# EAGLE design audio_webcam_final (EAGLE 7.7.0)
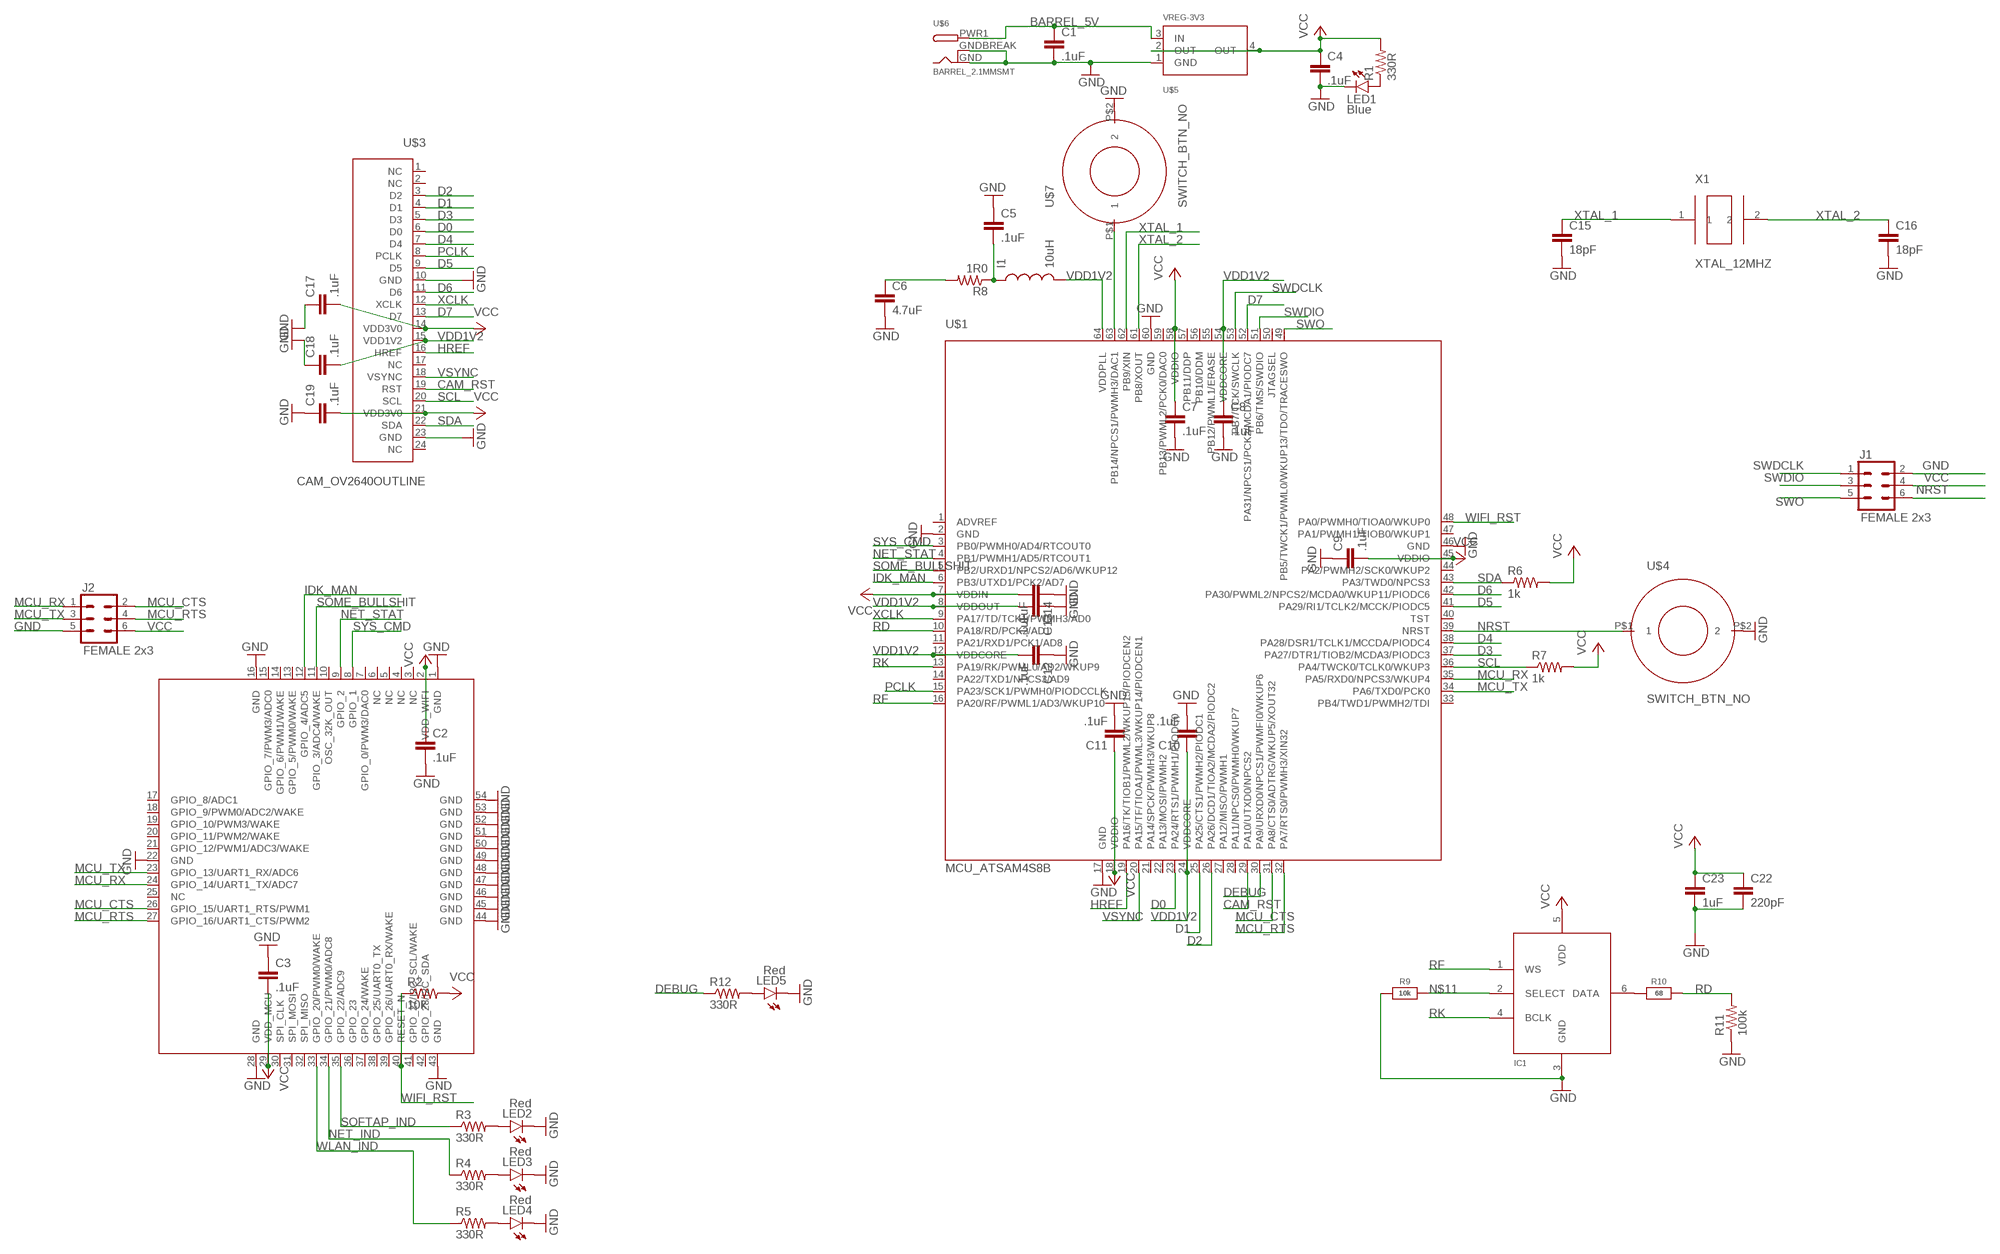
[diagram p0: schematic, sheet 1]

## Parts
C1  .1uF  CAP  [0805]
C2  .1uF  CAP  [0805]
C3  .1uF  CAP  [0805]
C4  .1uF  CAP  [0805]
C5  .1uF  CAP  [0805]
C6  4.7uF  CAP  [0805]
C7  .1uF  CAP  [0805]
C8  .1uF  CAP  [0805]
C9  .1uF  CAP  [0805]
C10  .1uF  CAP  [0805]
C11  .1uF  CAP  [0805]
C12  .1uF  CAP  [0805]
C13  .1uF  CAP  [0805]
C14  .1uF  CAP  [0805]
C15  18pF  CAP  [0805]
C16  18pF  CAP  [0805]
C17  .1uF  CAP  [0805]
C18  .1uF  CAP  [0805]
C19  .1uF  CAP  [0805]
C22  220pF  CAP  [0805]
C23  1uF  CAP  [0805]
I1  10uH  IND  [0805]
IC1  MIC_I2S_SPH0645  [SPH0645LM4H]
J1  FEMALE 2x3  CONN_03X2FEMALE  [2X3]
J2  FEMALE 2x3  CONN_03X2FEMALE  [2X3]
LED1  Blue  LED0603  [LED-0603]
LED2  Red  LED0603  [LED-0603]
LED3  Red  LED0603  [LED-0603]
LED4  Red  LED0603  [LED-0603]
LED5  Red  LED0603  [LED-0603]
R1  330R  RES  [0805]
R2  10k  RES  [0805]
R3  330R  RES  [0805]
R4  330R  RES  [0805]
R5  330R  RES  [0805]
R6  1k  RES  [0805]
R7  1k  RES  [0805]
R8  1R0  RES  [0805]
R9  10k  RESISTOR_0603_NOOUT  [0603-NO]
R10  68  RESISTOR_0603_NOOUT  [0603-NO]
R11  100k  RES  [0805]
R12  330R  RES  [0805]
U$1  MCU_ATSAM4S8B  [QFP50P1200X1200X160-64N]
U$2  WIFI_AMW004  [AMW004]
U$3  CAM_OV2640OUTLINE  [CAM_CONN]
U$4  SWITCH_BTN_NO  [BTN_2]
U$5  VREG-3V3  [R-PDSO-G4_TI]
U$6  BARREL_2.1MMSMT  [DCJACK_2MM_SMT]
U$7  SWITCH_BTN_NO  [BTN_2]
X1  XTAL_12MHZ  [ABM7-16.000MHZ-D2Y-T]

## Nets
BARREL_5V: C1.1 U$5.3(IN) U$6.PWR1(PWR)
CAM_RST: U$1.29(PA10/UTXD0/NPCS2) U$3.19(RST)
D0: U$1.23(PA24/RTS1/PWMH1/PIODC0) U$3.6(D0)
D1: U$1.25(PA25/CTS1/PWMH2/PIODC1) U$3.4(D1)
D2: U$1.26(PA26/DCD1/TIOA2/MCDA2/PIODC2) U$3.3(D2)
D3: U$1.37(PA27/DTR1/TIOB2/MCDA3/PIODC3) U$3.5(D3)
D4: U$1.38(PA28/DSR1/TCLK1/MCCDA/PIODC4) U$3.7(D4)
D5: U$1.41(PA29/RI1/TCLK2/MCCK/PIODC5) U$3.9(D5)
D6: U$1.42(PA30/PWML2/NPCS2/MCDA0/WKUP11/PIODC6) U$3.11(D6)
D7: U$1.52(PA31/NPCS1/PCK2/MCDA1/PIODC7) U$3.13(D7)
DEBUG: R12.1 U$1.30(PA9/URXD0/NPCS1/PWMFI0/WKUP6)
GND: C1.2 C2.2 C3.1 C4.2 C5.1 C6.2 C7.2 C8.2 C9.1 C10.2 C11.2 C12.1 C13.1 C14.1 C15.2 C16.2 C17.1 C18.1 C19.1 C22.2 C23.2 IC1.3(GND) J1.2 J2.5 LED1.C LED2.C LED3.C LED4.C LED5.C R9.1 R11.1 U$1.2(GND) U$1.17(GND) U$1.46(GND) U$1.60(GND) U$2.1(GND) U$2.16(GND) U$2.22(GND) U$2.28(GND) U$2.43(GND) U$2.44(GND) U$2.45(GND) U$2.46(GND) U$2.47(GND) U$2.48(GND) U$2.49(GND) U$2.50(GND) U$2.51(GND) U$2.52(GND) U$2.53(GND) U$2.54(GND) U$3.10(GND) U$3.23(GND) U$4.P$2 U$5.1(GND) U$6.GND U$6.GNDBREAK U$7.P$2
HREF: U$1.19(PA16/TK/TIOB1/PWML2/WKUP15/PIODCEN2) U$3.16(HREF)
IDK_MAN: U$1.6(PB3/UTXD1/PCK2/AD7) U$2.12(GPIO_4/ADC5)
MCU_CTS: J2.2 U$1.31(PA8/CTS0/ADTRG/WKUP5/XOUT32) U$2.26(GPIO_15/UART1_RTS/PWM1)
MCU_RTS: J2.4 U$1.32(PA7/RTS0/PWMH3/XIN32) U$2.27(GPIO_16/UART1_CTS/PWM2)
MCU_RX: J2.1 U$1.35(PA5/RXD0/NPCS3/WKUP4) U$2.24(GPIO_14/UART1_TX/ADC7)
MCU_TX: J2.3 U$1.34(PA6/TXD0/PCK0) U$2.23(GPIO_13/UART1_RX/ADC6)
N$1: LED2.A R3.2
N$2: LED3.A R4.2
N$3: LED4.A R5.2
N$4: C5.2 I1.1 R8.1
N$5: C6.1 R8.2
N$6: LED1.A R1.1
N$7: U$1.63(PB14/NPCS1/PWMH3/DAC1) U$7.P$1
N$8: LED5.A R12.2
N$11: IC1.2(SELECT) R9.2
N$12: IC1.6(DATA) R10.1
NET_IND: R4.1 U$2.34(GPIO_21/PWM0/ADC8)
NET_STAT: U$1.4(PB1/PWMH1/AD5/RTCOUT1) U$2.9(GPIO_2)
NRST: J1.6 U$1.39(NRST) U$4.P$1
PCLK: U$1.15(PA23/SCK1/PWMH0/PIODCCLK) U$3.8(PCLK)
RD: R10.2 R11.2 U$1.10(PA18/RD/PCK2/AD1)
RF: IC1.1(WS) U$1.16(PA20/RF/PWML1/AD3/WKUP10)
RK: IC1.4(BCLK) U$1.13(PA19/RK/PWML0/AD2/WKUP9)
SCL: R7.1 U$1.36(PA4/TWCK0/TCLK0/WKUP3) U$3.20(SCL)
SDA: R6.1 U$1.43(PA3/TWD0/NPCS3) U$3.22(SDA)
SOFTAP_IND: R3.1 U$2.35(GPIO_22/ADC9)
SOME_BULLSHIT: U$1.5(PB2/URXD1/NPCS2/AD6/WKUP12) U$2.11(GPIO_3/ADC4/WAKE)
SWDCLK: J1.1 U$1.53(PB7/TCK/SWCLK)
SWDIO: J1.3 U$1.51(PB6/TMS/SWDIO)
SWO: J1.5 U$1.49(PB5/TWCK1/PWML0/WKUP13/TDO/TRACESWO)
SYS_CMD: U$1.3(PB0/PWMH0/AD4/RTCOUT0) U$2.8(GPIO_1)
VCC: C2.1 C3.2 C4.1 C7.1 C9.2 C11.1 C14.2 C17.2 C19.2 C22.1 C23.1 IC1.5(VDD) J1.4 J2.6 R1.2 R2.2 R6.2 R7.2 U$1.7(VDDIN) U$1.18(VDDIO) U$1.45(VDDIO) U$1.58(VDDIO) U$2.2(VDD_WIFI) U$2.29(VDD_MCU) U$3.14(VDD3V0) U$3.21(VDD3V0) U$5.2(OUT) U$5.4(OUT)
VDD1V2: C8.1 C10.1 C12.2 C13.2 C18.2 I1.2 U$1.8(VDDOUT) U$1.12(VDDCORE) U$1.24(VDDCORE) U$1.54(VDDCORE) U$1.64(VDDPLL) U$3.15(VDD1V2)
VSYNC: U$1.20(PA15/TF/TIOA1/PWML3/WKUP14/PIODCEN1) U$3.18(VSYNC)
WIFI_RST: R2.1 U$1.48(PA0/PWMH0/TIOA0/WKUP0) U$2.40(RESET_N)
WLAN_IND: R5.1 U$2.33(GPIO_20/PWM0/WAKE)
XCLK: U$1.9(PA17/TD/TCK1/PWMH3/AD0) U$3.12(XCLK)
XTAL_1: C15.1 U$1.62(PB9/XIN) X1.1
XTAL_2: C16.1 U$1.61(PB8/XOUT) X1.2
Unconnected: U$1.1(ADVREF) U$1.11(PA21/RXD1/PCK1/AD8) U$1.14(PA22/TXD1/NPCS3/AD9) U$1.21(PA14/SPCK/PWMH3/WKUP8) U$1.22(PA13/MOSI/PWMH2) U$1.27(PA12/MISO/PWMH1) U$1.28(PA11/NPCS0/PWMH0/WKUP7) U$1.33(PB4/TWD1/PWMH2/TDI) U$1.40(TST) U$1.44(PA2/PWMH2/SCK0/WKUP2) U$1.47(PA1/PWMH1/TIOB0/WKUP1) U$1.50(JTAGSEL) U$1.55(PB12/PWML1/ERASE) U$1.56(PB10/DDM) U$1.57(PB11/DDP) U$1.59(PB13/PWML2/PCK0/DAC0) U$2.3(NC) U$2.4(NC) U$2.5(NC) U$2.6(NC) U$2.7(GPIO_0/PWM3/DAC0) U$2.10(OSC_32K_OUT) U$2.13(GPIO_5/PWM0/WAKE) U$2.14(GPIO_6/PWM1/WAKE) U$2.15(GPIO_7/PWM3/ADC0) U$2.17(GPIO_8/ADC1) U$2.18(GPIO_9/PWM0/ADC2/WAKE) U$2.19(GPIO_10/PWM3/WAKE) U$2.20(GPIO_11/PWM2/WAKE) U$2.21(GPIO_12/PWM1/ADC3/WAKE) U$2.25(NC) U$2.30(SPI_CLK) U$2.31(SPI_MOSI) U$2.32(SPI_MISO) U$2.36(GPIO_23) U$2.37(GPIO_24/WAKE) U$2.38(GPIO_25/UART0_TX) U$2.39(GPIO_26/UART0_RX/WAKE) U$2.41(GPIO_27/I2C_SCL/WAKE) U$2.42(GPIO_28/I2C_SDA) U$3.1(NC) U$3.2(NC) U$3.17(NC) U$3.24(NC)

## Library data of the parts
C1-C19 C22 C23 = Ilya_Teach:CAP
I1 = Ilya_Teach:IND
IC1 = Adafruit I2S Mic SPK0415HM4H:MIC_I2S
J1 J2 = SparkFun-Connectors:CONN_03X2: Multi connection point. Often used as Generic Header-pin footprint for 0.1 inch spaced/style header connections You can populate with any combo of single row headers, but if you'd like an exact match, check these: Header - 2x3 (Male, 0.1") <https://www.sparkfun.com/products/12807> (PRT-12807) Header - 2x3 (Female, 0.1") <https://www.sparkfun.com/products/13010> (PRT-13010) 2x3 Pin Shrouded Header <https://www.sparkfun.com/products/10877> (PRT-10877) On any of the 0.1 inch spaced packages, you can populate with these: Break Away Headers - Straight <https://www.sparkfun.com/products/116> (PRT-00116) Break Away Male Headers - Right Angle <https://www.sparkfun.com/products/553> (PRT-00553) Female Headers <https://www.sparkfun.com/products/115> (PRT-00115) Break Away Headers - Machine Pin <https://www.sparkfun.com/products/117> (PRT-00117) Break Away Female Headers - Swiss Machine Pin <https://www.sparkfun.com/products/743> (PRT-00743) Special note: the shrouded connector mates well with our 3x2 ribbon cables: Ribbon Crimp Connector - 6-pin (2x3, Female) <https://www.sparkfun.com/products/10651> (PRT-10651) Ribbon Cable - 6 wire (15ft) <https://www.sparkfun.com/products/10646> (PRT-10646); PROD_ID: CONN-11566
LED1-LED5 = Ilya_Teach:LED: LEDs Standard schematic elements and footprints for 5mm, 3mm, 1206, and 0603 sized LEDs. 5mm - Spark Fun Electronics SKU : COM-00529 (and others)
R1-R8 R11 R12 = Ilya_Teach:RES
R9 R10 = Adafruit I2S Mic SPK0415HM4H:RESISTOR: Resistors For new designs, use the packages preceded by an '_' character since they are more reliable: The following footprints should be used on most boards: _0402 - Standard footprint for regular board layouts _0603 - Standard footprint for regular board layouts _0805 - Standard footprint for regular board layouts _1206 - Standard footprint for regular board layouts For extremely tight-pitch boards where space is at a premium, the following 'micro-pitch' footprints can be used (smaller pads, no silkscreen outline, etc.): _0402MP - Micro-pitch footprint for very dense/compact boards _0603MP - Micro-pitch footprint for very dense/compact boards _0805MP - Micro-pitch footprint for very dense/compact boards _1206MP - Micro-pitch footprint for very dense/compact boards
U$1 = Ilya_Teach:MCU_ATSAM4S8B
U$2 = Ilya_Teach:WIFI_AMW004
U$3 = Ilya_Teach:CAM_OV2640
U$4 U$7 = Ilya_Teach:SWITCH_BTN_NO
U$5 = Ilya_Teach:VREG-3V3
U$6 = Ilya_Teach:BARREL_2.1MM
X1 = Ilya_Teach:XTAL_12MHZ

## Board
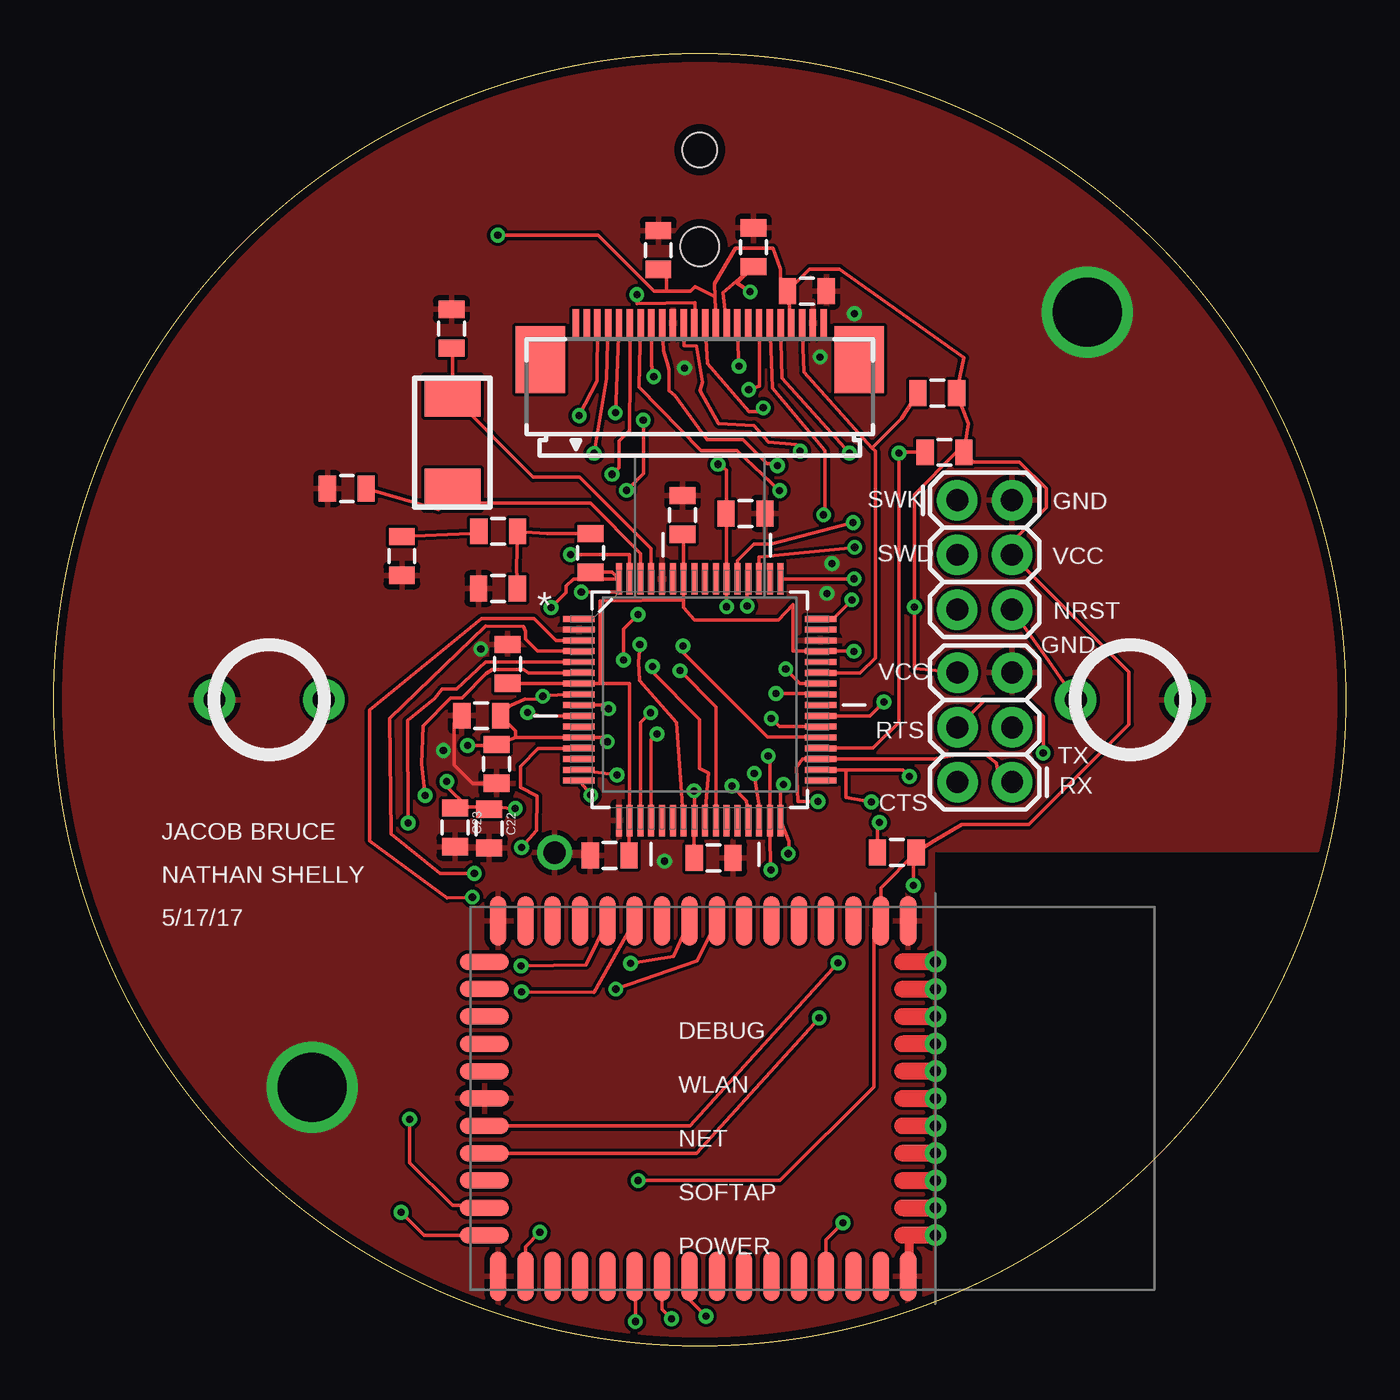
[diagram p1: board, top side]
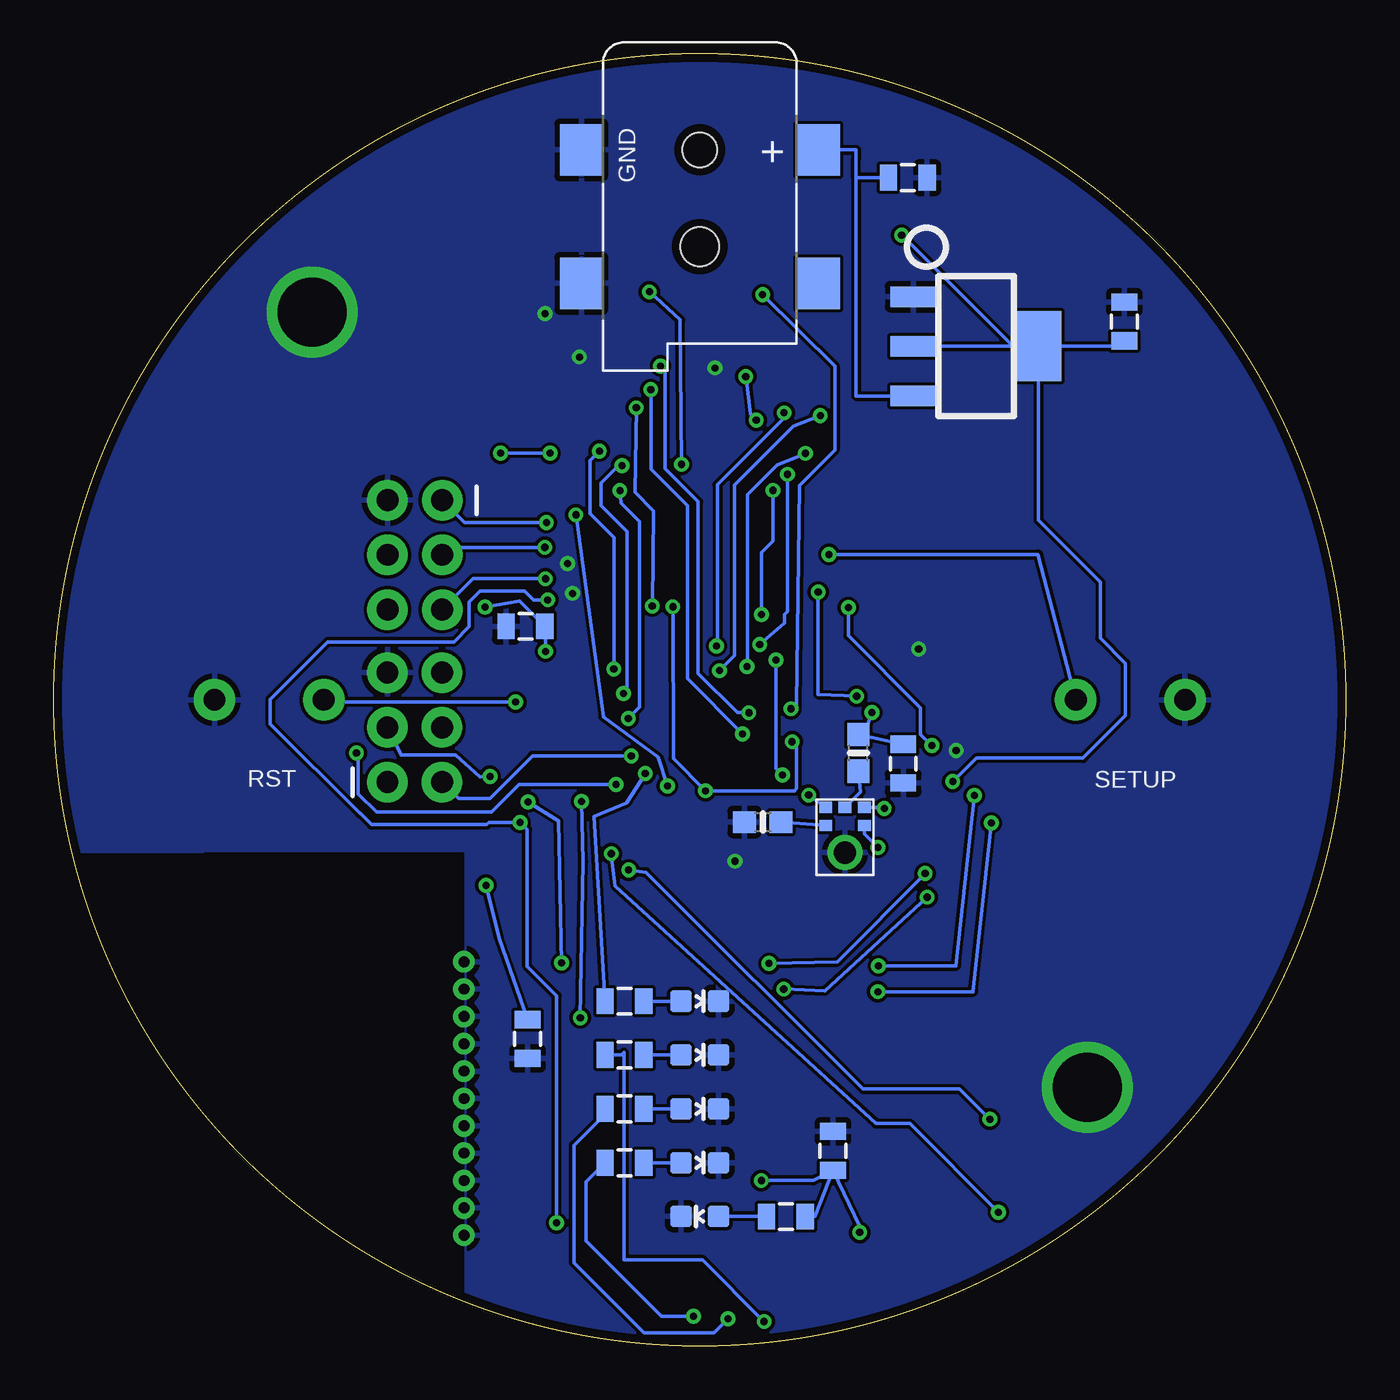
[diagram p2: board, bottom side, seen from below]

Size 60 x 60 mm. Coordinates in mm from the lower left corner, seen from the top.
Outline: circle at 30,30 radius 30
Copper layers (1*16): Top 0.0356mm / dielectric 1.5011mm / Bottom 0.0356mm
Design rules "LaenPCBOrder": minimum track width 6mil, minimum drill 13mil, track to track 6mil, track to pad 6mil, pad to pad 6mil, via to via 6mil, smd to smd 6mil, copper to edge 15mil, drill to drill 6mil, minimum pad ring 7mil, minimum via ring 7mil, stop-mask expansion 3mil, vias tented up to drill 0mil, thermal gap 10mil
tRestrict: area 53,11.1 to 58.9,22.9
bRestrict: area 53,11.1 to 58.9,22.9

### Footprints (pad centres in the part's own frame; a part is rotated, then mirrored left to right if it is on the bottom)
0805 = smd 0.8 x 1.2: 1 -0.9,0; 2 0.9,0
SPH0645LM4H = smd 0.6 x 0.525: 1 -0.9,1.4; 2 -0.9,0.55; 4 0.9,0.55; 5 0.9,1.4; 6 0,1.4 | drill 1.025 pad 1.625: 3 0,-0.71
2X3 = drill 1.016 pad 1.88: 1 0,0; 2 0,2.54; 3 2.54,0; 4 2.54,2.54; 5 5.08,0; 6 5.08,2.54
LED-0603 = smd 1 x 1: A 0,-0.877; C 0,0.877
0603-NO = smd 1.075 x 1: 1 -0.85,0; 2 0.85,0
QFP50P1200X1200X160-64N = smd 1.473 x 0.279: 1 -5.613,3.759; 2 -5.613,3.251; 3 -5.613,2.743; 4 -5.613,2.261; 5 -5.613,1.753; 6 -5.613,1.245; 7 -5.613,0.762; 8 -5.613,0.254; 9 -5.613,-0.254; 10 -5.613,-0.762; 11 -5.613,-1.245; 12 -5.613,-1.753; 13 -5.613,-2.261; 14 -5.613,-2.743; 15 -5.613,-3.251; 16 -5.613,-3.759; 33 5.613,-3.759; 34 5.613,-3.251; 35 5.613,-2.743; 36 5.613,-2.261; 37 5.613,-1.753; 38 5.613,-1.245; 39 5.613,-0.762; 40 5.613,-0.254; 41 5.613,0.254; 42 5.613,0.762; 43 5.613,1.245; 44 5.613,1.753; 45 5.613,2.261; 46 5.613,2.743; 47 5.613,3.251; 48 5.613,3.759 | smd 0.279 x 1.473: 17 -3.759,-5.613; 18 -3.251,-5.613; 19 -2.743,-5.613; 20 -2.261,-5.613; 21 -1.753,-5.613; 22 -1.245,-5.613; 23 -0.762,-5.613; 24 -0.254,-5.613; 25 0.254,-5.613; 26 0.762,-5.613; 27 1.245,-5.613; 28 1.753,-5.613; 29 2.261,-5.613; 30 2.743,-5.613; 31 3.251,-5.613; 32 3.759,-5.613; 49 3.759,5.613; 50 3.251,5.613; 51 2.743,5.613; 52 2.261,5.613; 53 1.753,5.613; 54 1.245,5.613; 55 0.762,5.613; 56 0.254,5.613; 57 -0.254,5.613; 58 -0.762,5.613; 59 -1.245,5.613; 60 -1.753,5.613; 61 -2.261,5.613; 62 -2.743,5.613; 63 -3.251,5.613; 64 -3.759,5.613
AMW004 = smd 0.762 x 2.286: 1 20.32,8.255; 2 19.05,8.255; 3 17.78,8.255; 4 16.51,8.255; 5 15.24,8.255; 6 13.97,8.255; 7 12.7,8.255; 8 11.43,8.255; 9 10.16,8.255; 10 8.89,8.255; 11 7.62,8.255; 12 6.35,8.255; 13 5.08,8.255; 14 3.81,8.255; 15 2.54,8.255; 16 1.27,8.255; 28 1.27,-8.255; 29 2.54,-8.255; 30 3.81,-8.255; 31 5.08,-8.255; 32 6.35,-8.255; 33 7.62,-8.255; 34 8.89,-8.255; 35 10.16,-8.255; 36 11.43,-8.255; 37 12.7,-8.255; 38 13.97,-8.255; 39 15.24,-8.255; 40 16.51,-8.255; 41 17.78,-8.255; 42 19.05,-8.255; 43 20.32,-8.255 | smd 2.286 x 0.762: 17 0.635,6.35; 18 0.635,5.08; 19 0.635,3.81; 20 0.635,2.54; 21 0.635,1.27; 22 0.635,0; 23 0.635,-1.27; 24 0.635,-2.54; 25 0.635,-3.81; 26 0.635,-5.08; 27 0.635,-6.35 | drill 0.5 pad 1: 44 21.59,-6.35; 45 21.59,-5.08; 46 21.59,-3.81; 47 21.59,-2.54; 48 21.59,-1.27; 49 21.59,0; 50 21.59,1.27; 51 21.59,2.54; 52 21.59,3.81; 53 21.59,5.08; 54 21.59,6.35
CAM_CONN = smd 0.3 x 1.3: 1 -5.75,3.25; 2 -5.25,3.25; 3 -4.75,3.25; 4 -4.25,3.25; 5 -3.75,3.25; 6 -3.25,3.25; 7 -2.75,3.25; 8 -2.25,3.25; 9 -1.75,3.25; 10 -1.25,3.25; 11 -0.75,3.25; 12 -0.25,3.25; 13 0.25,3.25; 14 0.75,3.25; 15 1.25,3.25; 16 1.75,3.25; 17 2.25,3.25; 18 2.75,3.25; 19 3.25,3.25; 20 3.75,3.25; 21 4.25,3.25; 22 4.75,3.25; 23 5.25,3.25; 24 5.75,3.25 | smd 2.3 x 3.1: P1 -7.4,1.55; P2 7.4,1.55
BTN_2 = drill 1.016 pad 1.93: P$1 -2.54,0; P$2 2.54,0
R-PDSO-G4_TI = smd 0.95 x 2.15: 1 -2.3,-2.9; 2 0,-2.9; 3 2.3,-2.9 | smd 3.25 x 2.15: 4 0,2.9
DCJACK_2MM_SMT = smd 2.4 x 2: GND -2.54,-5.5; GNDBREAK 3.66,-5.5; PWR1 -2.54,5.5; PWR2 3.66,5.5 | hole 1.6: -2.54,0 | hole 1.8: 1.96,0
ABM7-16.000MHZ-D2Y-T = smd 1.9 x 2.6: 1 -2.15,0; 2 2.15,0

### Placement (x,y rotation side)
C1  20.34,54.25 0 bottom
C2  21.07,31.67 90 top
C3  25.81,22.77 0 top
C4  38.09,33.41 180 bottom
C5  20.63,35.16 0 top
C6  16.17,36.68 270 top
C7  34.98,48.98 0 top
C8  32.12,38.65 0 top
C9  28.07,50.89 270 top
C10  32.49,51.02 90 top
C11  29.2,38.58 90 top
C12  19.85,29.26 0 top
C13  30.64,22.65 180 top
C14  37.99,14.24 90 bottom
C15  13.61,39.81 180 top
C16  18.47,47.23 90 top
C17  23.81,9.05 270 bottom
C18  20.57,27.02 90 top
C19  10.28,47.57 270 bottom
C22  20.22,24.02 270 top
C23  18.63,24.07 270 top
I1  24.93,36.82 270 top
IC1  23.25,23.61 0 bottom
J1  41.96,39.27 270 top
J2  44.51,26.18 90 top
LED1  30,6 90 bottom
LED2  30,8.5 270 bottom
LED3  30,11 270 bottom
LED4  30,13.5 270 bottom
LED5  30,16 270 bottom
R1  26,6 0 bottom
R2  39.15,22.91 0 top
R3  33.5,8.5 0 bottom
R4  33.5,11 0 bottom
R5  33.5,13.5 0 bottom
R6  41.03,44.24 0 top
R7  41.37,41.49 0 top
R8  20.63,37.82 180 top
R9  27.07,24.32 0 bottom
R10  22.63,27.53 90 bottom
R11  20.55,27.03 90 bottom
R12  33.5,16 0 bottom
U$1  30,30 0 top
U$2  19.36,11.48 0 top
U$3  30,44.25 0 top
U$4  50,30 0 top
U$5  17.17,46.42 270 bottom
U$6  30,53 270 bottom
U$7  10,30 180 top
X1  18.52,41.94 90 top

### Tracks (layer width: path | path; a pad name or v marks a point on that pad's centre or on a via)
BARREL_5V
  Bottom 0.152: U$6.PWR1 22.74,55.54 22.74,55.13 22.74,54.25 | 22.74,54.25 22.74,44.11 U$5.3 | C1.1 22.74,54.25
CAM_RST  (via drill 0.33)
  Top 0.152: U$3.19 33.38,44.47 35.81,41.58 35.81,38.86 v35.75,38.59 | v31.5,26 32.17,25.3 U$1.29
  Bottom 0.152: v35.75,38.59 34.47,29.21 31.94,27.34 v31.5,26
D0  (via drill 0.33)
  Top 0.152: U$1.23 28.93,28.94 27.2,30.9 27.16,31.76 v27.22,32.56 | U$3.6 26.75,47.41 26.75,44.02 26.73,43.6 26.73,42.5 26.24,42.01 26.24,40.78 v25.93,40.47
  Bottom 0.152: v27.22,32.56 26.06,33.55 26.06,33.97 25.93,34.1 v25.93,40.47
D1  (via drill 0.33)
  Top 0.152: U$3.4 25.66,44.91 v25.09,41.44 | v27.8,31.54 27.8,31.28 29.99,29.09 29.99,26.8 30.4,26.59 30.23,24.41 U$1.25
  Bottom 0.152: v25.09,41.44 26.42,40.9 27.79,39.53 27.79,31.55 v27.8,31.54
D2  (via drill 0.33)
  Top 0.152: U$3.3 25.24,44.8 v24.4,43.19 | v29.08,31.35 30.76,29.67 U$1.26
  Bottom 0.152: v24.4,43.19 25.65,42.71 28.38,39.98 28.38,32.05 v29.08,31.35
D3  (via drill 0.33)
  Top 0.152: U$3.5 26.08,43.27 v26.08,43.33 | v29.22,32.5 29.22,32.2 33.14,28.28 35.58,28.28 U$1.37
  Bottom 0.152: v26.08,43.33 26.13,43.04 29.18,39.99 29.18,32.54 v29.22,32.5
D4  (via drill 0.33)
  Top 0.152: U$3.7 27.18,44.51 30.06,41.57 31.74,41.57 v33.71,39.72 | v33.32,29.13 33.7,28.76 U$1.38
  Bottom 0.152: v33.71,39.72 33.66,39.13 32.8,38.27 32.8,29.65 v33.32,29.13
D5  (via drill 0.33)
  Top 0.152: v33.62,40.88 33.63,40.98 33.11,40.98 32.01,42.08 30.33,42.08 28.84,44.13 28.58,44.36 28.58,45.32 28.51,45.61 28.33,46.12 28.32,46.24 U$3.9 | v33.55,30.29 35.58,30.29 U$1.41
  Bottom 0.152: v33.62,40.88 33.72,40.93 34.59,40.06 34.59,39.01 33.38,37.8 33.38,30.45 v33.55,30.29
D6  (via drill 0.33)
  Top 0.152: v34.66,41.55 34.5,41.85 33.2,41.97 32.52,42.73 30.87,42.83 30,44.35 30.12,44.74 29.84,46.43 29.28,46.45 U$3.11 | v33.99,31.43 34.66,30.76 U$1.42
  Bottom 0.152: v34.66,41.55 35.1,41.12 35.1,38.64 33.99,37.53 v33.99,31.43
D7  (via drill 0.33)
  Top 0.152: U$3.13 30.36,45.6 32.28,43.39 32.75,43.39 v32.95,43.56 | v32.2,34.36 32.2,35.55 U$1.52
  Bottom 0.152: v32.95,43.56 33.02,39.64 32.15,38.77 32.2,34.4 v32.2,34.36
DEBUG  (via drill 0.33)
  Top 0.152: U$1.30 32.74,25.14 v32.53,26.57
  Bottom 0.152: v32.53,26.57 33.4,25.21 34.91,24.58 R12.1
GND  (via drill 0.33, 3.2)
  Top 0.152: C12.1 18.59,28.9 18.59,26.97 19.44,26.12 C18.1
  Top 0.406: U$2.43 39.73,3.23 39.73,5.13 U$2.44
  other vias: 29.29,45.41 35.91,34.94 37.18,47.93 19.83,32.36 36.14,36.32 28.36,22.5 12,12 48,48 18.09,27.65 35.59,45.92
  pour Bottom: -20,29.95 -20,32 arc-90 28.05,80.05 30.8,80.05 arc-90 80.5,30.35 80.5,29.85 arc-90 30.25,-20.4 29.5,-20.4 arc-90 -20,29.1
  pour Top: -20.05,30.05 -20.05,30.45 arc-90 29.7,80.2 30.15,80.2 arc-90 80.35,30 80.35,29.85 arc-90 30.15,-20.35 29.9,-20.35 arc-90 -20.05,29.6
HREF  (via drill 0.33)
  Top 0.152: U$1.19 27.26,28.93 v27.72,29.4 | v31.82,45.5 31.8,45.78 U$3.16
  Bottom 0.152: v27.72,29.4 28.25,29.4 30.07,31.22 30.07,39.2 31.61,40.74 31.61,45.29 v31.82,45.5
IDK_MAN  (via drill 0.33)
  Top 0.152: U$1.6 22.05,31.24 21.83,31.4 20.38,31.4 20.08,31.22 18.95,30.09 18.43,30.09 17.15,28.77 17.08,27.02 v17.25,25.55 | U$2.12 24.71,17.69 v21.7,17.64
  Bottom 0.152: v21.7,17.64 18.1,17.64 v17.25,25.55
MCU_CTS  (via drill 0.33)
  Top 0.152: v33.18,27.39 33.25,27.32 U$1.31 33.26,23.26 v33.3,22.09 | v16.53,10.52 16.53,8.5 18.51,6.52 19.88,6.52 U$2.26
  Bottom 0.152: v33.18,27.39 37.77,27.39 39.75,25.41 41.2,25.41 J2.2 | v33.3,22.09 32.49,21.99 22.42,11.92 17.93,11.92 v16.53,10.52
MCU_RTS  (via drill 0.33)
  Top 0.152: v33.89,26.06 33.76,25.93 U$1.32 34.14,23.42 v34.11,22.85 | v45.95,27.53 45.95,29.22 45.17,30 43.25,30 J2.4 | v16.13,6.2 17.2,5.13 U$2.27
  Bottom 0.152: v33.89,26.06 38.39,26.06 39.67,24.78 45.01,24.78 45.86,25.63 45.86,27.44 v45.95,27.53 | v34.11,22.85 33.93,21.36 21.82,10.32 20.25,10.32 v16.13,6.2
MCU_RX  (via drill 0.33)
  Top 0.152: J2.1 43.98,25.7 43.79,27.06 43.29,27.43 41.87,27.43 40.87,27.25 U$1.35 34.78,27.26 34.49,26.86 34.55,25.27 v35.49,25.28 | U$2.24 29.84,8.94 v35.55,15.23
  Bottom 0.152: v35.55,15.23 35.41,22.47 v35.49,25.28
MCU_TX  (via drill 0.33)
  Top 0.152: U$1.34 36.8,26.75 | 36.8,26.75 39.44,26.75 v39.74,26.44 | v37.97,25.25 36.8,25.46 36.8,26.75 | U$2.23 29.55,10.21 v36.42,17.78
  Bottom 0.152: v39.74,26.44 40.21,26.42 41.35,27.42 43.86,27.44 J2.3 | v36.42,17.78 36.56,24.36 v37.97,25.25
N$1
  Bottom 0.152: R3.2 LED2.A
N$2
  Bottom 0.152: R4.2 LED3.A
N$3
  Bottom 0.152: R5.2 LED4.A
N$4
  Top 0.152: I1.1 22.91,37.73 R8.1 21.48,36.12 C5.2
N$5
  Top 0.152: R8.2 19.35,37.72 C6.1
N$6
  Bottom 0.152: R1.1 LED1.A
N$7  (via drill 0.33)
  Top 0.152: U$1.63 26.75,36.75 v24,36.75
  Bottom 0.152: v24,36.75 14.29,36.75 U$7.P$1
N$8
  Bottom 0.152: R12.2 LED5.A
N$11
  Bottom 0.152: IC1.2 R9.2
N$12
  Bottom 0.152: IC1.6 22.53,25.73 R10.1
NET_IND  (via drill 0.33)
  Top 0.152: U$2.34 28.25,1.69 v28.69,1.25
  Bottom 0.152: v28.69,1.25 29.34,0.6 32.59,0.6 35.84,3.85 35.84,9.31 34.4,10.75 R4.1
NET_STAT  (via drill 0.33)
  Top 0.152: U$1.4 22.47,32.26 21.92,32.81 21.92,33.17 21.82,33.41 20.05,33.42 15.59,29.14 15.67,23.77 17.95,21.93 v19.53,21.93 | U$2.9 28.78,18.08 v26.78,17.75
  Bottom 0.152: v26.78,17.75 23.61,17.83 v19.53,21.93
NRST  (via drill 0.33)
  Top 0.152: U$1.39 37.9,29.24 v38.55,29.89 | J1.6 46.18,31.82 U$4.P$1
  Bottom 0.152: v38.55,29.89 47.35,29.89 U$4.P$1
PCLK  (via drill 0.33)
  Top 0.152: U$3.8 27.76,45.55 v27.86,45.01 | v27.38,42.98 27.38,40.5 v26.6,39.73 | v26.16,26.51 24.4,26.74 U$1.15 | v27.13,33.96 26.46,33.28 v26.46,31.84
  Bottom 0.152: v27.86,45.01 27.65,43.26 v27.38,42.98 | v26.6,39.73 26.6,37.37 27.13,36.84 v27.13,33.96 | v26.16,26.51 26.46,26.81 v26.46,31.84
RD  (via drill 0.33)
  Top 0.152: U$1.10 22.59,29.24 v22.01,29.41
  Bottom 0.152: v22.01,29.41 22.52,27.95 R10.2 R11.2
RF  (via drill 0.33)
  Top 0.152: v24.94,25.57 U$1.16
  Bottom 0.152: IC1.1 v24.94,25.57
RK  (via drill 0.33)
  Top 0.152: U$1.13 22.5,27.74 21.67,26.91 21.67,25.92 22.45,25.52 22.41,23.92 v21.73,23.14
  Bottom 0.152: v21.73,23.14 22.35,23.76 IC1.4
SCL  (via drill 0.33)
  Top 0.152: U$3.20 33.83,44.93 v36.95,41.45 | U$1.36 35.62,27.75 38.05,27.75 39.25,28.95 v39.25,41.45 39.29,41.49 R7.1
  Bottom 0.152: v36.95,41.45 v39.25,41.45
SDA
  Top 0.152: U$3.22 34.85,45.21 38.01,41.7 | 38.01,41.7 38.15,41.55 38.15,31.95 37.45,31.25 U$1.43 | R6.1 39.37,43.06 38.01,41.7
SOFTAP_IND  (via drill 0.33)
  Top 0.152: U$2.35 29.52,2.14 v30.29,1.37
  Bottom 0.152: v30.29,1.37 31.78,1.37 35.28,4.87 35.28,7.62 R3.1
SOME_BULLSHIT  (via drill 0.33)
  Top 0.152: U$1.5 20.05,31.75 18.7,30.49 18.04,30.49 17.69,30.05 16.42,29.03 v16.46,24.28 | U$2.11 25.09,16.41 v21.73,16.44
  Bottom 0.152: v21.73,16.44 17.31,16.44 v16.46,24.28
SWDCLK  (via drill 0.33)
  Top 0.152: U$1.53 31.75,36.47 32.52,37.24 33.31,37.24 v37.12,38.23
  Bottom 0.152: v37.12,38.23 40.92,38.23 J1.1
SWDIO  (via drill 0.33)
  Top 0.152: U$1.51 32.76,36.62 v37.2,37.08
  Bottom 0.152: v37.2,37.08 41.61,37.08 J1.3
SWO  (via drill 0.33)
  Top 0.152: U$1.49 v37.16,35.61 v37.17,35.62
  Bottom 0.152: v37.17,35.62 40.53,35.62 J1.5
SYS_CMD  (via drill 0.33)
  Top 0.152: U$1.3 23.34,32.74 22.31,33.77 19.86,33.77 14.67,29.52 14.67,23.45 18.27,20.79 v19.44,20.83 | U$2.8 29.87,17.88 v26.1,16.56
  Bottom 0.152: v26.1,16.56 24.18,16.48 v19.44,20.83
VCC  (via drill 0.33)
  Top 0.152: v37.16,32.25 37.15,32.26 U$1.45 34.32,32.26 34.32,34.43 33.65,33.71 29.75,33.71 29.24,34.27 29.25,34.62 | U$3.21 C7.1 | C2.1 22.19,30.76 U$1.7 25.38,30.76 | C11.1 29.24,37.64 U$1.58 29.25,34.62 | 25.38,30.76 26.75,30.76 U$1.18 26.71,24.35 C3.2 | 29.25,34.62 25.36,34.57 25.38,30.76 | C7.1 35.1,50 36.49,50 42.28,45.88 R6.2 42.47,42.84 R7.2 | R7.2 41.92,41.49 39.97,39.54 v39.97,34.31 39.97,31.45 J2.6 | v20.62,51.58 25.28,51.58 27.88,48.98 28.45,48.98 | 28.45,48.98 29.57,48.98 29.78,49.19 30.71,48.73 U$3.14 30.69,49.32 31.67,50.97 33.4,50.97 33.74,49.99 33.74,49.31 C7.1 | R7.2 42.71,41.05 44.84,41.05 46.09,39.8 46.09,38.92 44.5,37.33 J1.4 49.94,31.29 49.94,28.86 45.28,24.2 42.18,24.2 40.87,23.44 R2.2 | C9.2 28.45,49.99 28.45,48.98 | v21.43,24.95 20.22,25.01 | 20.22,25.01 C22.1 | 20.22,25.01 19.22,25.01 | 19.22,25.01 18.63,25.01 C23.1 | R2.2 38.41,21.27 U$2.2 38.08,19.41 38.08,12.03 33.72,7.67 v27.14,7.67 | U$2.29 21.9,4.59 v22.57,5.26 | v39.93,21.38 39.93,22.79 R2.2 | v18.25,26.2 18.25,25.98 19.22,25.01
  Bottom 0.152: v37.16,32.25 37.16,32.99 C4.1 38.37,34.59 v39.97,34.31 | U$5.2 U$5.4 | 10.28,46.42 C19.2 10.53,46.42 U$5.4 | U$5.4 14.27,38.34 11.4,35.47 11.4,32.86 10.23,31.69 10.23,29.26 12.2,27.29 17.16,27.29 v18.25,26.2 | U$5.4 15.35,46.42 | U$5.4 15.46,46.42 v20.62,51.58 | IC1.5 21.55,25.01 v21.43,24.95 | v22.57,5.26 22.57,5.51 C17.2 | R1.2 24.66,6 C17.2 | C14.2 39.33,18.95 v39.93,21.38 | C17.2 24.73,7.67 v27.14,7.67
VDD1V2  (via drill 0.33)
  Top 0.152: U$3.15 31.08,48.91 C10.1 31.72,49.35 v32.34,48.95 | I1.2 25.93,35.92 U$1.64 | 31.24,38.63 C8.1 | U$1.8 23.75,30.25 v22.71,30.16 22.56,30 21.89,30.04 21.22,29.73 C12.2 21.45,28.55 21.45,28.25 | 21.45,28.25 U$1.12 25.51,28.25 v25.71,28.05 | 21.45,28.25 C18.2 | 31.24,38.63 31.24,40.67 v30.85,40.94 | 31.24,38.63 U$1.54 31.24,34.41 v31.25,34.32 | C13.2 U$1.24 29.75,25.75 v29.73,25.77 | U$1.64 26.24,35 v24.5,35 | U$1.64 24.13,35.61 23.8,35.28 23.8,34.98 v23.1,34.28 | v19.22,27.87 20.62,27.87 20.63,27.86
  Bottom 0.152: v30.85,40.94 30.91,47.65 v32.34,48.95 | v24.5,35 24.5,30.25 v22.71,30.16 | v25.71,28.05 25.51,27.85 25.51,25.87 25.61,25.77 v29.73,25.77 31.23,27.27 v31.25,34.32 | v23.1,34.28 23.1,32.98 19.74,29.62 19.74,28.39 v19.22,27.87
VSYNC  (via drill 0.33)
  Top 0.152: U$3.18 32.77,47.34 32.77,44.57 v32.27,44.4 | v28.02,28.41 27.74,28.14 U$1.20
  Bottom 0.152: v32.27,44.4 32.27,40.71 30.58,39.02 30.58,30.98 v28.02,28.41
WIFI_RST  (via drill 0.33)
  Top 0.152: U$1.48 36.18,33.76 v37.06,34.64 | R2.1 38.25,24.2 v38.35,24.3 | U$2.40 35.87,4.92 v36.65,5.7
  Bottom 0.152: v37.06,34.64 37.73,34.64 38.13,35.04 40.21,35.04 40.71,34.54 40.71,33.39 41.41,32.69 47.28,32.69 49.95,30.02 49.95,28.88 45.78,24.71 45.76,24.71 45.25,24.2 39.89,24.2 39.79,24.3 v38.35,24.3 38.02,23.97 38.02,17.62 36.65,16.25 v36.65,5.7
WLAN_IND  (via drill 0.33)
  Top 0.152: U$2.33 27.01,3.2 v27.01,1.12
  Bottom 0.152: v27.01,1.12 29.87,3.98 33.5,3.98 33.52,4 33.52,13.62 33.64,13.5 R5.1
XCLK  (via drill 0.33)
  Top 0.152: U$3.12 29.78,48.45 27.08,48.4 v27.08,48.82 | v25.76,29.58 25.59,29.75 U$1.9
  Bottom 0.152: v27.08,48.82 23.73,45.5 23.73,41.6 25.37,39.95 25.52,29.76 25.59,29.76 v25.76,29.58
XTAL_1
  Top 0.152: U$1.62 27.26,36.79 24.92,39.12 19.19,39.12 X1.1 17.87,38.84 C15.1
XTAL_2
  Top 0.152: U$1.61 27.74,37.03 24.43,40.34 22.27,40.34 X1.2 18.52,46.29 C16.1

### Text on the board
tPlace: SWK | GND | SWD | VCC | NRST | GND | VCC | RTS | TX | RX | CTS | JACOB BRUCE | NATHAN SHELLY | 5/17/17 | DEBUG | WLAN | NET | SOFTAP | POWER
bPlace: SETUP | RST